# EAGLE design BME680-Breakout_v10_ (EAGLE 8.3.2)
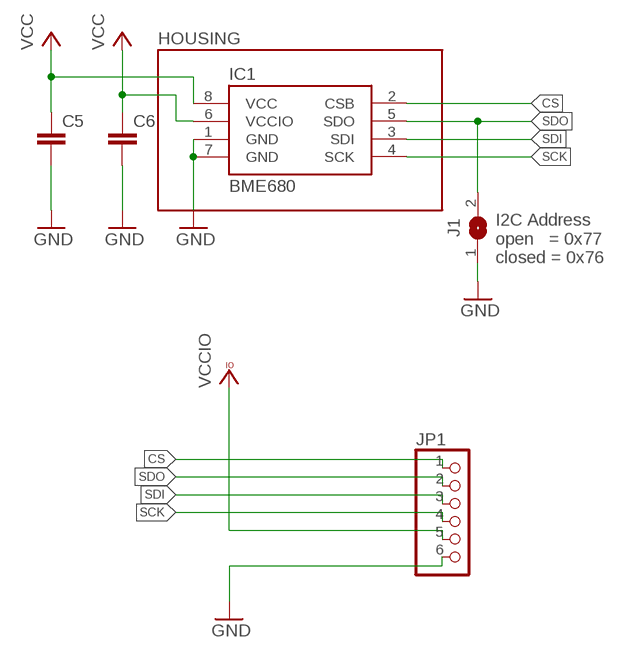
[diagram p0: schematic, sheet 1]

## Parts
C5  CAP0805  [0805]
C6  CAP0805  [0805]
HOUSING  SF2  [SF2]
IC1  BME680  [BME680]
J1  JUMPER2-0603  [JUMPER2-0603]
JP1  PINHD-1X6  [1X06]

## Nets
CS: IC1.2(CSB) JP1.1
GND: C5.2 C6.2 IC1.1(GND) IC1.7(GND) J1.1 JP1.6
SCK: IC1.4(SCK) JP1.4
SDI: IC1.3(SDI) JP1.3
SDO: IC1.5(SDO) J1.2 JP1.2
VCC: C5.1 C6.1 IC1.6(VCCIO) IC1.8(VCC) JP1.5 ; supply symbol labelled VCCIO

## Notes on the sheet
- I2C Address
  open   = 0x77
  closed = 0x76

## Library data of the parts
C5 C6 = SparkFun-Passives:CAP: Capacitor Standard 0603 ceramic capacitor, and 0.1" leaded capacitor.
HOUSING = we-sensor:SF2
IC1 = we-sensor:BME680: Bosch BME280 Humidity, Pressure, Air Quality Sensor
J1 = we-rcl:JUMPER2: 2 Pin Jumpers
JP1 = adafruit:PINHD-1X6: PIN HEADER

## Board
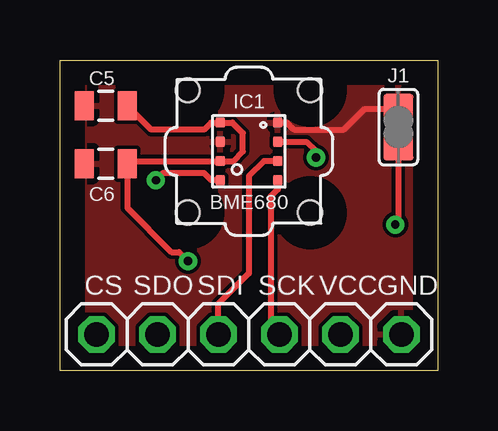
[diagram p1: board, top side]
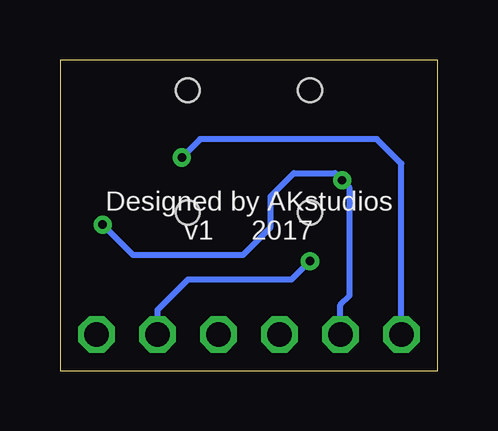
[diagram p2: board, bottom side, seen from below]

Size 15.75 x 12.95 mm. Coordinates in mm from the lower left corner, seen from the top.
Outline: 0,0 0,12.95 15.75,12.95 15.75,0 0,0
Copper layers (1*16): Top 0.035mm / dielectric 1.5mm / Bottom 0.035mm
Design rules "default": minimum track width 6mil, minimum drill 0.35mm, track to track 6mil, track to pad 6mil, pad to pad 6mil, via to via 6mil, smd to smd 6mil, copper to edge 40mil, drill to drill 6mil, minimum pad ring 10mil, minimum via ring 8mil, stop-mask expansion 4mil, vias tented up to drill 0mil, thermal gap 10mil

### Footprints (pad centres in the part's own frame; a part is rotated, then mirrored left to right if it is on the bottom)
0805 = smd 0.8 x 1.2: 1 -0.9,0; 2 0.9,0
SF2 = hole 1: -2.55,-2.55; 2.55,-2.55; 2.55,2.55; -2.55,2.55
BME680 = smd 0.4 x 0.4: 1 1.2,1.2; 2 1.2,0.4; 3 1.2,-0.4; 4 1.2,-1.2; 5 -1.2,-1.2; 6 -1.2,-0.4; 7 -1.2,0.4; 8 -1.2,1.2
JUMPER2-0603 = smd 1.25 x 1.25: 1 0,0.76; 2 0,-0.76
1X06 = drill 1.016 octagon: 1 -6.35,0; 2 -3.81,0; 3 -1.27,0; 4 1.27,0; 5 3.81,0; 6 6.35,0

### Placement (x,y rotation side)
C5  1.9,11.05 180 top
C6  1.9,8.64 180 top
HOUSING  7.87,9.14 0 top
IC1  7.87,9.14 0 top
J1  14.1,10.16 0 top
JP1  7.87,1.52 0 top

### Tracks (layer width: path | path; a pad name or v marks a point on that pad's centre or on a via)
CS  (via drill 0.35)
  Top 0.254: v10.67,8.89 10.67,9.14 10.27,9.54 IC1.2
  Bottom 0.254: JP1.1 1.52,8.64 2.54,9.65 9.91,9.65 v10.67,8.89
GND
  Top 0.254: IC1.1 9.45,10.34 9.74,10.05 11.83,10.05 12.7,10.92 J1.1
  pour Top: -0.25,13.21 -0.25,-0.25 16,-0.25 16,13.21
SCK
  Top 0.254: IC1.4 9.07,7.57 8.78,7.28 8.78,1.89 JP1.4
SDI
  Top 0.254: JP1.3 6.6,2.79 7.87,4.06 7.87,8.13 8.49,8.74 IC1.3
SDO  (via drill 0.35)
  Top 0.254: J1.2 14.1,6.22 v13.97,6.1 | IC1.5 6.3,7.94 6.01,8.24 4.29,8.24 v3.99,7.94
  Bottom 0.254: JP1.2 4.06,2.75 3.68,3.13 3.68,7.63 v3.99,7.94 4.29,8.24 6.01,8.24 6.97,7.28 6.97,5.99 8.13,4.83 12.7,4.83 v13.97,6.1
VCC  (via drill 0.35)
  Top 0.254: C5.1 3.8,10.05 6.01,10.05 6.3,10.34 IC1.8 7.18,10.34 7.62,9.91 7.62,9.14 7.22,8.74 IC1.6 2.91,8.74 C6.1 | 2.79,8.62 C6.1 | v5.33,4.57 4.96,4.95 4.64,4.95 2.81,6.79 C6.1
  Bottom 0.254: JP1.5 11.68,2.54 10.41,3.81 6.1,3.81 v5.33,4.57

### Text on the board
tPlace: CS | SDO | SDI | SCK | VCC | GND
bPlace: Designed by AKstudios / v1 2017